# EAGLE design pcb_eagle (EAGLE 7.7.0)
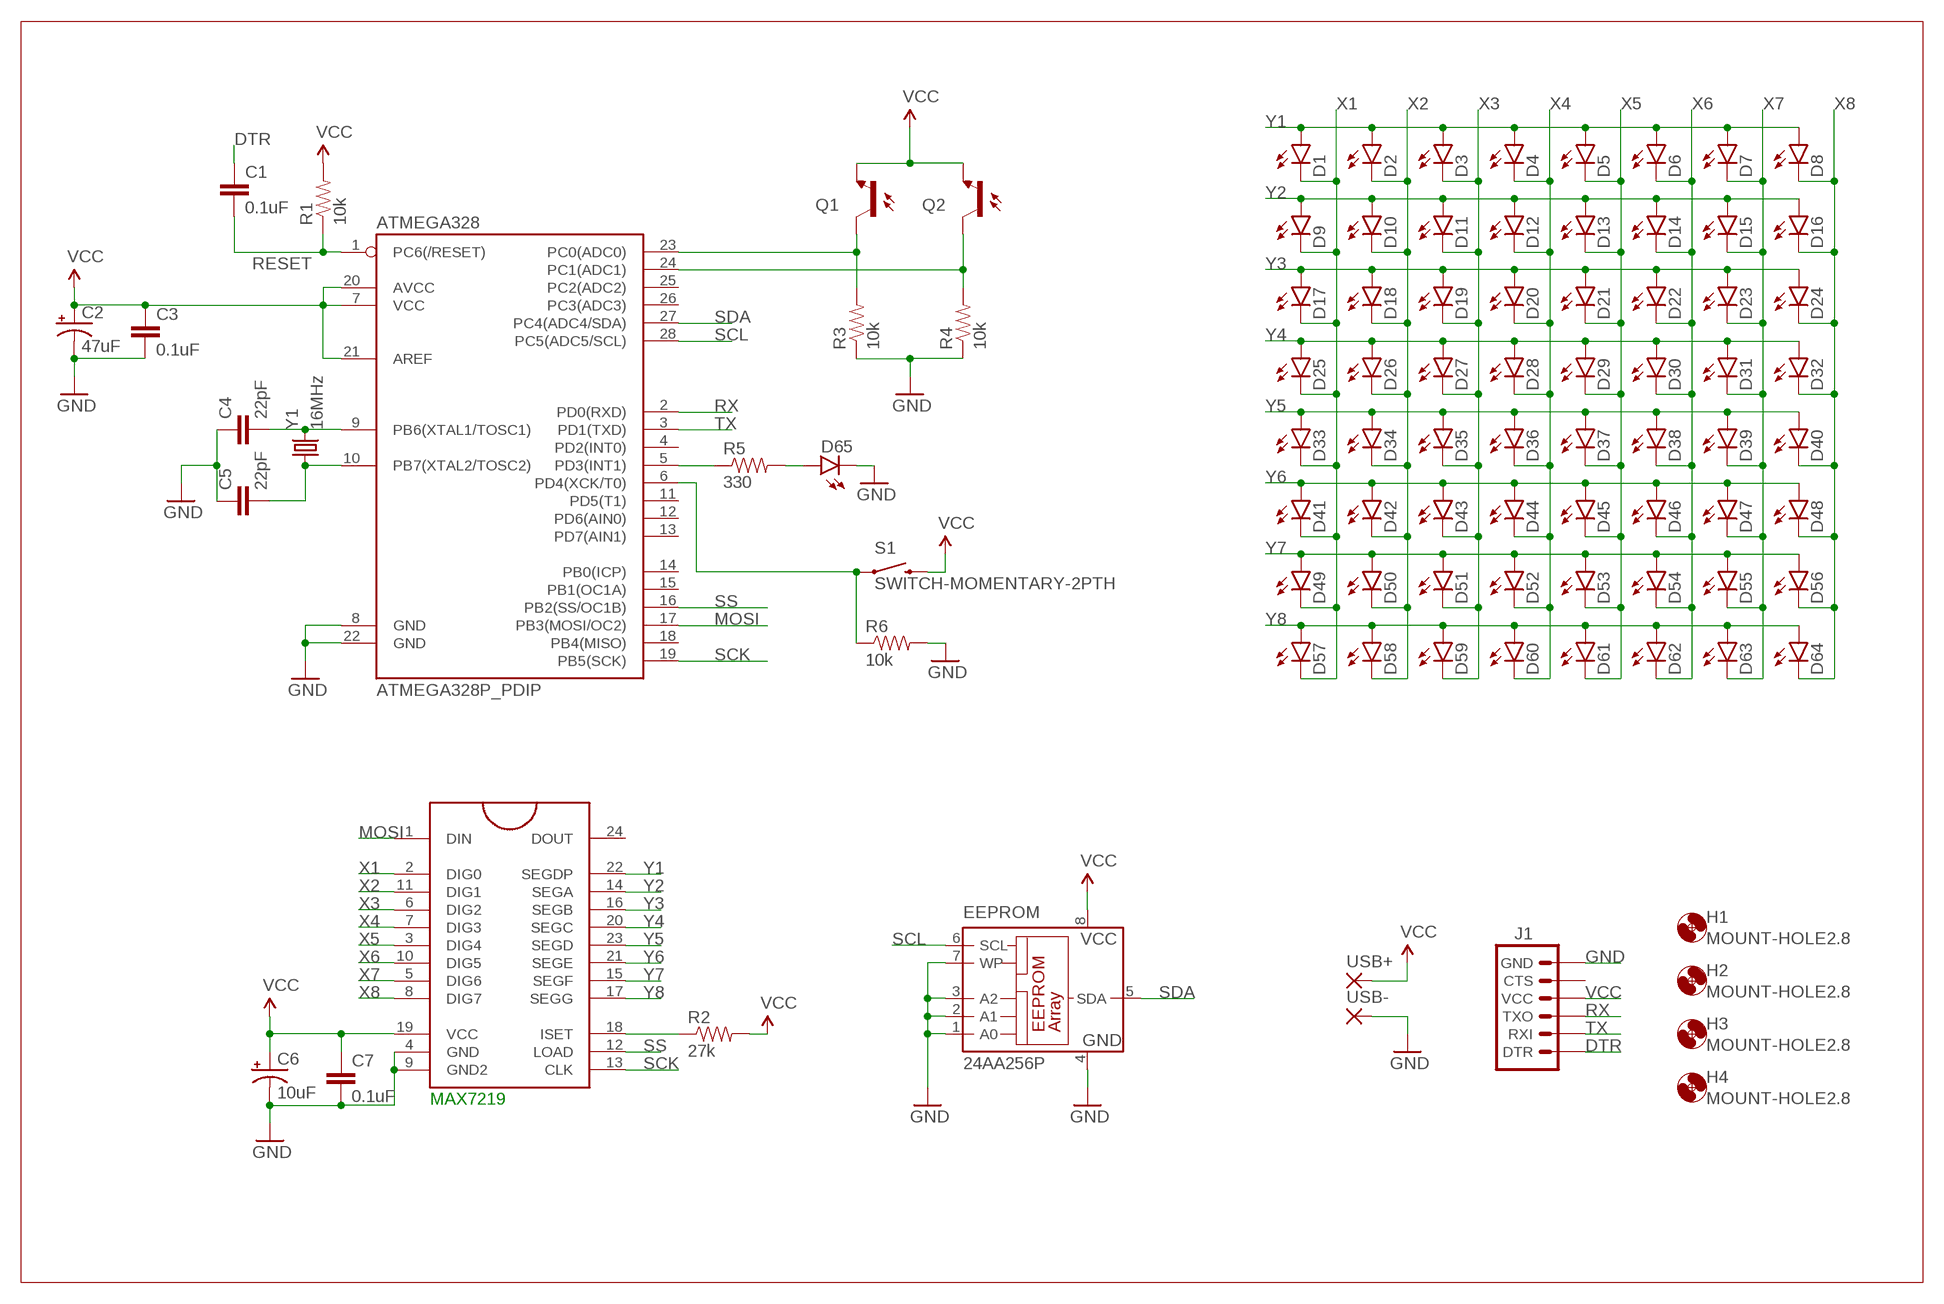
[diagram p0: schematic, sheet 1]

## Parts
ATMEGA328  ATMEGA328P_PDIP  [DIL28-3]
C1  0.1uF  CAPPTH  [CAP-PTH-SMALL]
C2  47uF  CAP_POLPTH2  [CPOL-RADIAL-10UF-25V]
C3  0.1uF  CAPPTH  [CAP-PTH-SMALL]
C4  22pF  CAPPTH  [CAP-PTH-SMALL]
C5  22pF  CAPPTH  [CAP-PTH-SMALL]
C6  10uF  CAP_POLPTH2  [CPOL-RADIAL-10UF-25V]
C7  0.1uF  CAPPTH  [CAP-PTH-SMALL]
D1  LED3MM  [LED3MM]
D2  LED3MM  [LED3MM]
D3  LED3MM  [LED3MM]
D4  LED3MM  [LED3MM]
D5  LED3MM  [LED3MM]
D6  LED3MM  [LED3MM]
D7  LED3MM  [LED3MM]
D8  LED3MM  [LED3MM]
D9  LED3MM  [LED3MM]
D10  LED3MM  [LED3MM]
D11  LED3MM  [LED3MM]
D12  LED3MM  [LED3MM]
D13  LED3MM  [LED3MM]
D14  LED3MM  [LED3MM]
D15  LED3MM  [LED3MM]
D16  LED3MM  [LED3MM]
D17  LED3MM  [LED3MM]
D18  LED3MM  [LED3MM]
D19  LED3MM  [LED3MM]
D20  LED3MM  [LED3MM]
D21  LED3MM  [LED3MM]
D22  LED3MM  [LED3MM]
D23  LED3MM  [LED3MM]
D24  LED3MM  [LED3MM]
D25  LED3MM  [LED3MM]
D26  LED3MM  [LED3MM]
D27  LED3MM  [LED3MM]
D28  LED3MM  [LED3MM]
D29  LED3MM  [LED3MM]
D30  LED3MM  [LED3MM]
D31  LED3MM  [LED3MM]
D32  LED3MM  [LED3MM]
D33  LED3MM  [LED3MM]
D34  LED3MM  [LED3MM]
D35  LED3MM  [LED3MM]
D36  LED3MM  [LED3MM]
D37  LED3MM  [LED3MM]
D38  LED3MM  [LED3MM]
D39  LED3MM  [LED3MM]
D40  LED3MM  [LED3MM]
D41  LED3MM  [LED3MM]
D42  LED3MM  [LED3MM]
D43  LED3MM  [LED3MM]
D44  LED3MM  [LED3MM]
D45  LED3MM  [LED3MM]
D46  LED3MM  [LED3MM]
D47  LED3MM  [LED3MM]
D48  LED3MM  [LED3MM]
D49  LED3MM  [LED3MM]
D50  LED3MM  [LED3MM]
D51  LED3MM  [LED3MM]
D52  LED3MM  [LED3MM]
D53  LED3MM  [LED3MM]
D54  LED3MM  [LED3MM]
D55  LED3MM  [LED3MM]
D56  LED3MM  [LED3MM]
D57  LED3MM  [LED3MM]
D58  LED3MM  [LED3MM]
D59  LED3MM  [LED3MM]
D60  LED3MM  [LED3MM]
D61  LED3MM  [LED3MM]
D62  LED3MM  [LED3MM]
D63  LED3MM  [LED3MM]
D64  LED3MM  [LED3MM]
D65  LED3MM  [LED3MM]
EEPROM  24AA256P  [DIL8]
H1  MOUNT-HOLE2.8  [2,8]
H2  MOUNT-HOLE2.8  [2,8]
H3  MOUNT-HOLE2.8  [2,8]
H4  MOUNT-HOLE2.8  [2,8]
J1  ARDUINO_SERIAL_PROGRAMPTH  [1X06]
MAX72191  MAX7219DIP  [DIL24]
Q1  PHOTOTRANSISTORT1  [LED3MM]
Q2  PHOTOTRANSISTORT1  [LED3MM]
R1  10k  RESISTORAXIAL-0.3  [AXIAL-0.3]
R2  27k  RESISTORAXIAL-0.3  [AXIAL-0.3]
R3  10k  RESISTORAXIAL-0.3  [AXIAL-0.3]
R4  10k  RESISTORAXIAL-0.3  [AXIAL-0.3]
R5  330  RESISTORAXIAL-0.3  [AXIAL-0.3]
R6  10k  RESISTORAXIAL-0.3  [AXIAL-0.3]
S1  SWITCH-MOMENTARY-2PTH  [TACTILE-PTH]
USB+  2,54/0,9  [2,54/0,9]
USB-  2,54/0,9  [2,54/0,9]
Y1  16MHz  CRYSTALHC49US  [HC49US]

## Nets
DTR: C1.1 J1.1(DTR)
GND: ATMEGA328.8(GND) ATMEGA328.22(GND) C2.2(-) C3.2 C4.1 C5.1 C6.2(-) C7.2 D65.K(C) EEPROM.1(A0) EEPROM.2(A1) EEPROM.3(A2) EEPROM.4(GND) EEPROM.7(WP) J1.6(GND) MAX72191.4(GND) MAX72191.9(GND2) R3.P$1 R4.P$1 R6.P$2 USB-.1(P)
MOSI: ATMEGA328.17(PB3(MOSI/OC2)) MAX72191.1(DIN)
N$1: ATMEGA328.9(PB6(XTAL1/TOSC1)) C4.2 Y1.2
N$2: ATMEGA328.10(PB7(XTAL2/TOSC2)) C5.2 Y1.1
N$3: MAX72191.18(ISET) R2.P$1
N$6: ATMEGA328.24(PC1(ADC1)) Q2.C R4.P$2
N$7: ATMEGA328.23(PC0(ADC0)) Q1.C R3.P$2
N$8: ATMEGA328.5(PD3(INT1)) R5.P$1
N$9: D65.A R5.P$2
N$12: ATMEGA328.6(PD4(XCK/T0)) R6.P$1 S1.1
RESET: ATMEGA328.1(PC6(/RESET)) C1.2 R1.P$1
RX: ATMEGA328.2(PD0(RXD)) J1.3(TXO)
SCK: ATMEGA328.19(PB5(SCK)) MAX72191.13(CLK)
SCL: ATMEGA328.28(PC5(ADC5/SCL)) EEPROM.6(SCL)
SDA: ATMEGA328.27(PC4(ADC4/SDA)) EEPROM.5(SDA)
SS: ATMEGA328.16(PB2(SS/OC1B)) MAX72191.12(LOAD)
TX: ATMEGA328.3(PD1(TXD)) J1.2(RXI)
VCC: ATMEGA328.7(VCC) ATMEGA328.20(AVCC) ATMEGA328.21(AREF) C2.1(+) C3.1 C6.1(+) C7.1 EEPROM.8(VCC) J1.4(VCC) MAX72191.19(VCC) Q1.E Q2.E R1.P$2 R2.P$2 S1.3 USB+.1(P)
X1: D1.K(C) D9.K(C) D17.K(C) D25.K(C) D33.K(C) D41.K(C) D49.K(C) D57.K(C) MAX72191.2(DIG0)
X2: D2.K(C) D10.K(C) D18.K(C) D26.K(C) D34.K(C) D42.K(C) D50.K(C) D58.K(C) MAX72191.11(DIG1)
X3: D3.K(C) D11.K(C) D19.K(C) D27.K(C) D35.K(C) D43.K(C) D51.K(C) D59.K(C) MAX72191.6(DIG2)
X4: D4.K(C) D12.K(C) D20.K(C) D28.K(C) D36.K(C) D44.K(C) D52.K(C) D60.K(C) MAX72191.7(DIG3)
X5: D5.K(C) D13.K(C) D21.K(C) D29.K(C) D37.K(C) D45.K(C) D53.K(C) D61.K(C) MAX72191.3(DIG4)
X6: D6.K(C) D14.K(C) D22.K(C) D30.K(C) D38.K(C) D46.K(C) D54.K(C) D62.K(C) MAX72191.10(DIG5)
X7: D7.K(C) D15.K(C) D23.K(C) D31.K(C) D39.K(C) D47.K(C) D55.K(C) D63.K(C) MAX72191.5(DIG6)
X8: D8.K(C) D16.K(C) D24.K(C) D32.K(C) D40.K(C) D48.K(C) D56.K(C) D64.K(C) MAX72191.8(DIG7)
Y1: D1.A D2.A D3.A D4.A D5.A D6.A D7.A D8.A MAX72191.22(SEGDP)
Y2: D9.A D10.A D11.A D12.A D13.A D14.A D15.A D16.A MAX72191.14(SEGA)
Y3: D17.A D18.A D19.A D20.A D21.A D22.A D23.A D24.A MAX72191.16(SEGB)
Y4: D25.A D26.A D27.A D28.A D29.A D30.A D31.A D32.A MAX72191.20(SEGC)
Y5: D33.A D34.A D35.A D36.A D37.A D38.A D39.A D40.A MAX72191.23(SEGD)
Y6: D41.A D42.A D43.A D44.A D45.A D46.A D47.A D48.A MAX72191.21(SEGE)
Y7: D49.A D50.A D51.A D52.A D53.A D54.A D55.A D56.A MAX72191.15(SEGF)
Y8: D57.A D58.A D59.A D60.A D61.A D62.A D63.A D64.A MAX72191.17(SEGG)
Unconnected: ATMEGA328.4(PD2(INT0)) ATMEGA328.11(PD5(T1)) ATMEGA328.12(PD6(AIN0)) ATMEGA328.13(PD7(AIN1)) ATMEGA328.14(PB0(ICP)) ATMEGA328.15(PB1(OC1A)) ATMEGA328.18(PB4(MISO)) ATMEGA328.25(PC2(ADC2)) ATMEGA328.26(PC3(ADC3)) J1.5(CTS) MAX72191.24(DOUT)

## Notes on the sheet
- MAX7219

## Library data of the parts
ATMEGA328 = SparkFun-DigitalIC:ATMEGA328P_PDIP: uC used in the Arduino 32kb flash, 1k EEPROM, 2k SRAM This is the through-hole version of this chip.
C1 C3-C5 C7 = SparkFun-Capacitors:CAP: Capacitor Standard 0603 ceramic capacitor, and 0.1" leaded capacitor.
C2 C6 = SparkFun-Capacitors:CAP_POL: Capacitor Polarized These are standard SMD and PTH capacitors. Normally 10uF, 47uF, and 100uF in electrolytic and tantalum varieties. Always verify the external diameter of the through hole cap, it varies with capacity, voltage, and manufacturer. The EIA devices should be standard.
D1-D65 = SparkFun-LED:LED: LEDs Standard schematic elements and footprints for 5mm, 3mm, 1206, and 0603 sized LEDs. 5mm - Spark Fun Electronics SKU : COM-00529 (and others); PROD_ID: DIO-08794
EEPROM = microchip:24*: Serial EEPROM I2C; MF: MICROCHIP; MPN: 24AA256-I/P; OC_FARNELL: 1331294; OC_NEWARK: 92C6872
H1-H4 = holes:MOUNT-HOLE: MOUNTING HOLE with drill center marker
J1 = SparkFun-Connectors:ARDUINO_SERIAL_PROGRAM: FTDI connector footprints
MAX72191 = SparkFun-DigitalIC:MAX7219: 8-digit, 8-segment LED display driver, serial input
Q1 Q2 = BobVanHove:PHOTOTRANSISTOR
R1 R3-R6 = SparkFun-Passives:RESISTOR: Resistor Basic schematic elements and footprints for 0603, 1206, and PTH resistors.
R2 = SparkFun-Resistors:RESISTOR: Resistor Basic schematic elements and footprints for 0603, 1206, and PTH resistors.
S1 = SparkFun-Electromechanical:SWITCH-MOMENTARY-2: Various NO switches- pushbuttons, reed, etc; PROD_ID: SWCH-08441
USB+ USB- = wirepad:2,54/0,9: THROUGH-HOLE PAD
Y1 = SparkFun-FreqCtrl:CRYSTAL: Various standard crystals. Proven footprints.

## Board
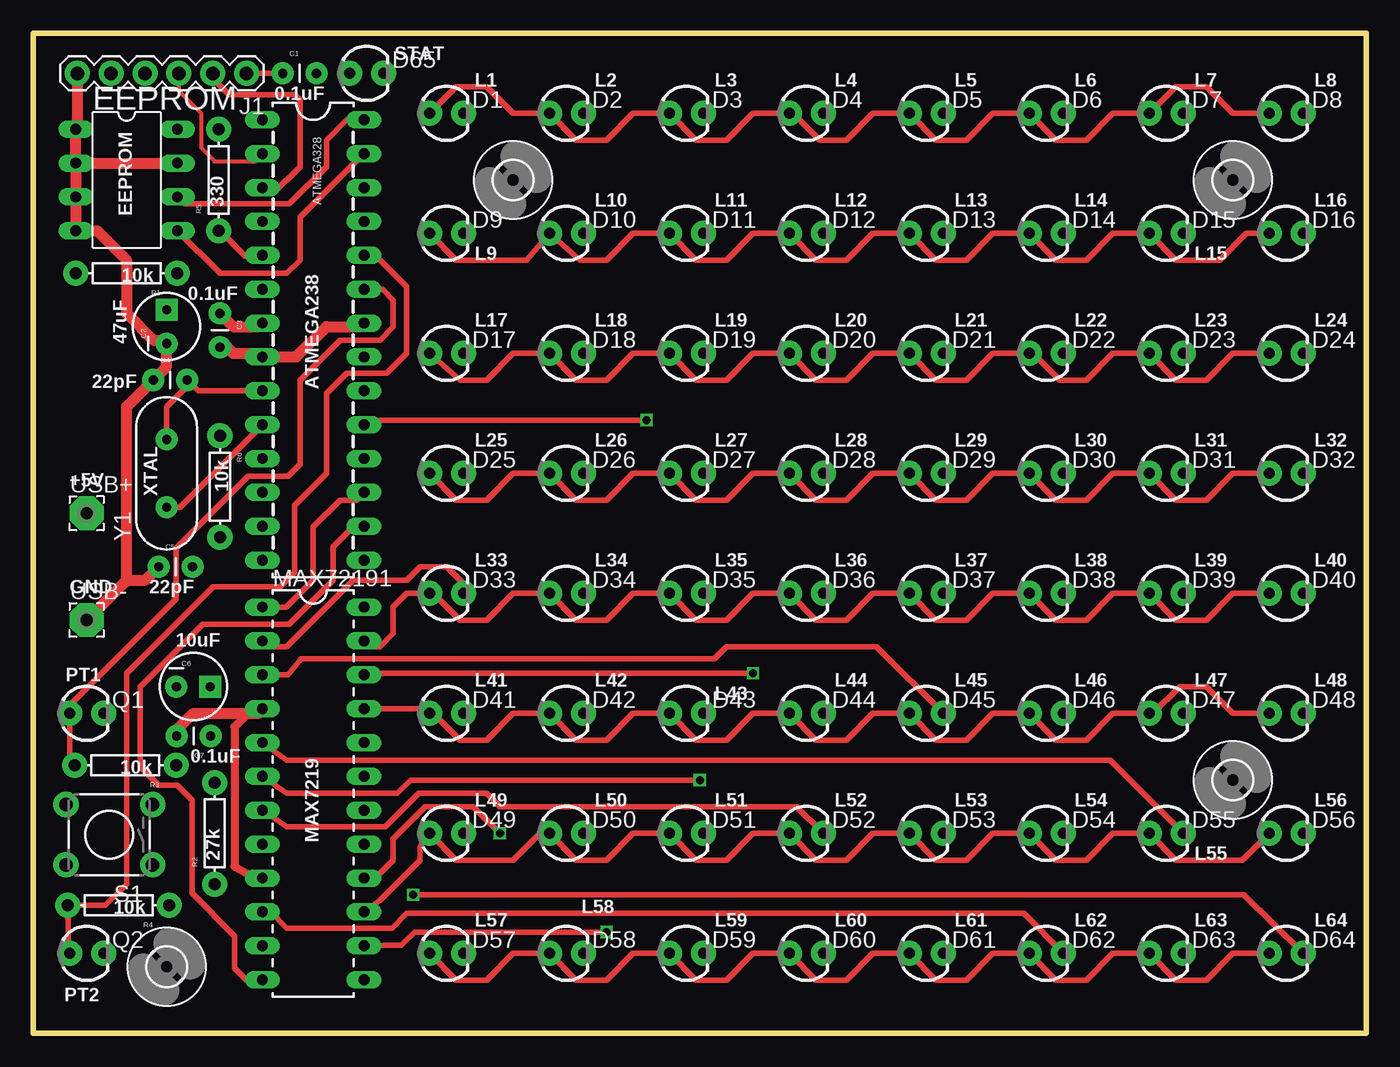
[diagram p1: board, top side]
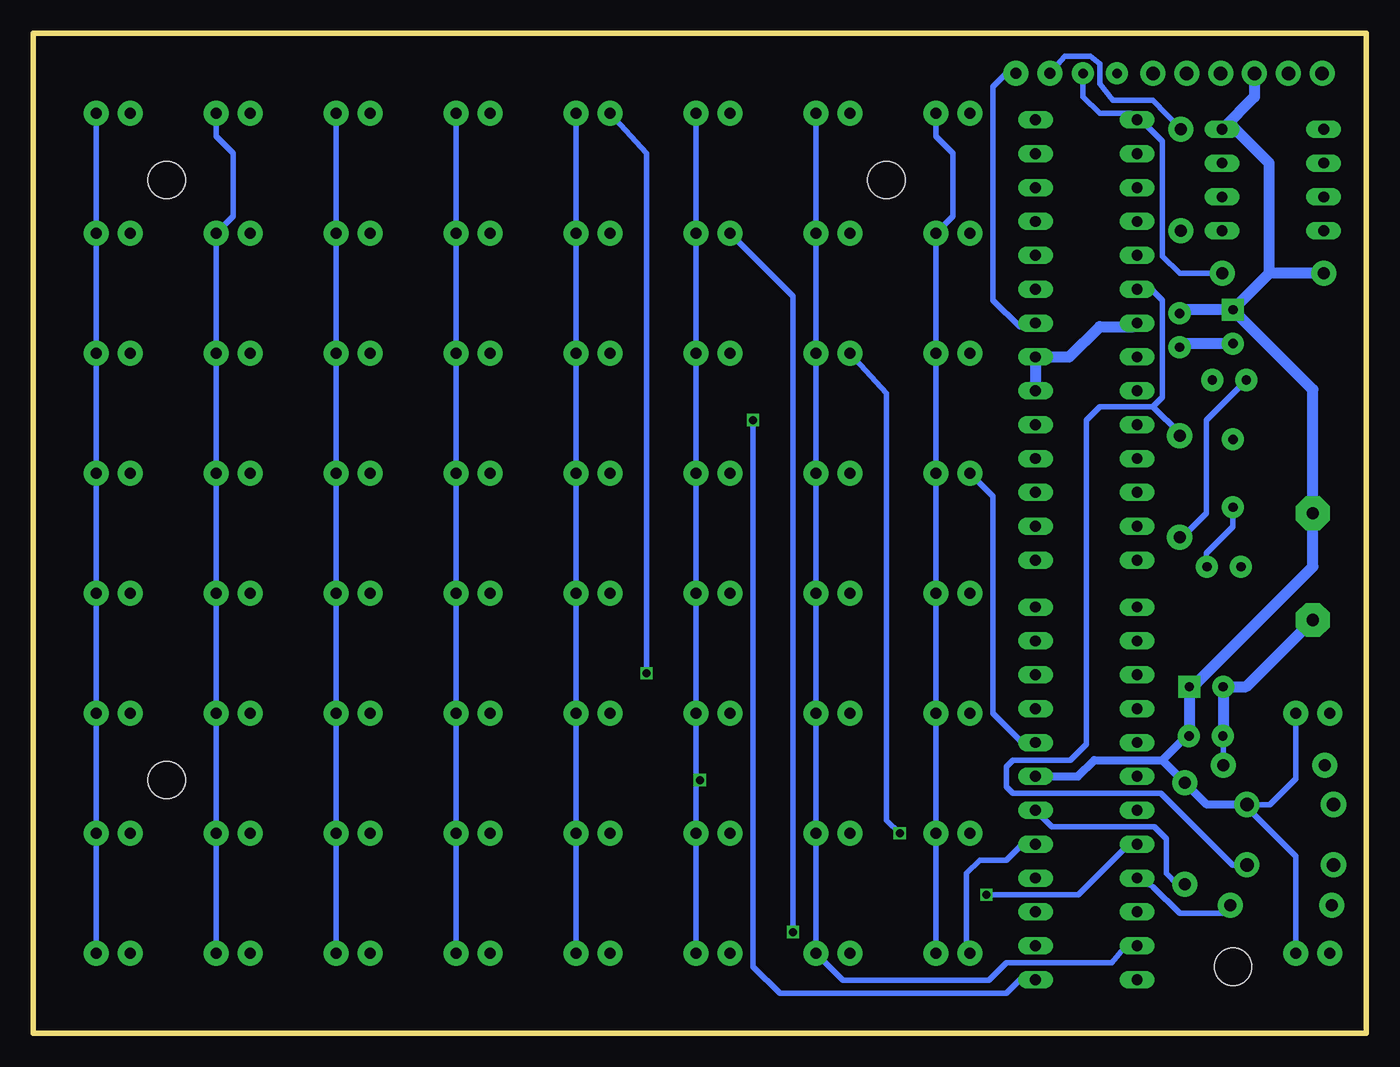
[diagram p2: board, bottom side, seen from below]

Size 100 x 75 mm. Coordinates in mm from the lower left corner, seen from the top.
Outline: 0,0 100,0 100,75 0,75 0,0
Copper layers (1*16): Top 0.035mm / dielectric 1.5mm / Bottom 0.035mm
Design rules "SeeedStudio_2layer_DRU_no_angle_20140221": minimum track width 6mil, minimum drill 12mil, track to track 6mil, track to pad 6mil, pad to pad 6mil, via to via 6mil, smd to smd 0mil, copper to edge 10mil, drill to drill 10mil, minimum pad ring 10mil, minimum via ring 6mil, stop-mask expansion 2mil, vias tented up to drill 100mil, thermal gap 10mil

### Footprints (pad centres in the part's own frame; a part is rotated, then mirrored left to right if it is on the bottom)
DIL28-3 = drill 0.813 long: 1 -16.51,-3.81; 2 -13.97,-3.81; 3 -11.43,-3.81; 4 -8.89,-3.81; 5 -6.35,-3.81; 6 -3.81,-3.81; 7 -1.27,-3.81; 8 1.27,-3.81; 9 3.81,-3.81; 10 6.35,-3.81; 11 8.89,-3.81; 12 11.43,-3.81; 13 13.97,-3.81; 14 16.51,-3.81; 15 16.51,3.81; 16 13.97,3.81; 17 11.43,3.81; 18 8.89,3.81; 19 6.35,3.81; 20 3.81,3.81; 21 1.27,3.81; 22 -1.27,3.81; 23 -3.81,3.81; 24 -6.35,3.81; 25 -8.89,3.81; 26 -11.43,3.81; 27 -13.97,3.81; 28 -16.51,3.81
CAP-PTH-SMALL = drill 0.7 pad 1.651: 1 0,0; 2 2.54,0
CPOL-RADIAL-10UF-25V = drill 0.7 pad 1.651 square: 1 1.27,0 | drill 0.7 pad 1.651: 2 -1.27,0
LED3MM = drill 0.813 pad 1.88: A -1.27,0; K 1.27,0
DIL8 = drill 0.813 long: 1 -3.81,-3.81; 2 -1.27,-3.81; 3 1.27,-3.81; 4 3.81,-3.81; 5 3.81,3.81; 6 1.27,3.81; 7 -1.27,3.81; 8 -3.81,3.81
2,8 = hole 2.8: 0,0
1X06 = drill 1.016 pad 1.88: 1 0,0; 2 2.54,0; 3 5.08,0; 4 7.62,0; 5 10.16,0; 6 12.7,0
DIL24 = drill 0.813 long: 1 -13.97,-3.81; 2 -11.43,-3.81; 3 -8.89,-3.81; 4 -6.35,-3.81; 5 -3.81,-3.81; 6 -1.27,-3.81; 7 1.27,-3.81; 8 3.81,-3.81; 9 6.35,-3.81; 10 8.89,-3.81; 11 11.43,-3.81; 12 13.97,-3.81; 13 13.97,3.81; 14 11.43,3.81; 15 8.89,3.81; 16 6.35,3.81; 17 3.81,3.81; 18 1.27,3.81; 19 -1.27,3.81; 20 -3.81,3.81; 21 -6.35,3.81; 22 -8.89,3.81; 23 -11.43,3.81; 24 -13.97,3.81
LED3MM' = drill 0.813 pad 1.88: C -1.27,0; E 1.27,0
AXIAL-0.3 = drill 0.9 pad 1.88: P$1 -3.81,0; P$2 3.81,0
TACTILE-PTH = drill 1.016 pad 1.88: 1 -3.251,2.261; 2 3.251,2.261; 3 -3.251,-2.261; 4 3.251,-2.261
2,54/0,9 = drill 0.914 pad 2.54 octagon: 1 0,0
HC49US = drill 0.7 pad 1.651: 1 -2.54,0; 2 2.54,0

### Placement (x,y rotation side)
ATMEGA328  21,52 270 top
C1  18.7,72 0 top
C2  10,53 90 top
C3  14,54 270 top
C4  9,49 0 top
C5  9.4,35 0 top
C6  12,26 0 top
C7  13.3,22.3 180 top
D1  31,69 0 top
D2  40,69 0 top
D3  49,69 0 top
D4  58,69 0 top
D5  67,69 0 top
D6  76,69 0 top
D7  85,69 0 top
D8  94,69 0 top
D9  31,60 0 top
D10  40,60 0 top
D11  49,60 0 top
D12  58,60 0 top
D13  67,60 0 top
D14  76,60 0 top
D15  85,60 0 top
D16  94,60 0 top
D17  31,51 0 top
D18  40,51 0 top
D19  49,51 0 top
D20  58,51 0 top
D21  67,51 0 top
D22  76,51 0 top
D23  85,51 0 top
D24  94,51 0 top
D25  31,42 0 top
D26  40,42 0 top
D27  49,42 0 top
D28  58,42 0 top
D29  67,42 0 top
D30  76,42 0 top
D31  85,42 0 top
D32  94,42 0 top
D33  31,33 0 top
D34  40,33 0 top
D35  49,33 0 top
D36  58,33 0 top
D37  67,33 0 top
D38  76,33 0 top
D39  85,33 0 top
D40  94,33 0 top
D41  31,24 0 top
D42  40,24 0 top
D43  49,24 0 top
D44  58,24 0 top
D45  67,24 0 top
D46  76,24 0 top
D47  85,24 0 top
D48  94,24 0 top
D49  31,15 0 top
D50  40,15 0 top
D51  49,15 0 top
D52  58,15 0 top
D53  67,15 0 top
D54  76,15 0 top
D55  85,15 0 top
D56  94,15 0 top
D57  31,6 0 top
D58  40,6 0 top
D59  49,6 0 top
D60  58,6 0 top
D61  67,6 0 top
D62  76,6 0 top
D63  85,6 0 top
D64  94,6 0 top
D65  25,72 0 top
EEPROM  7,64 270 top
H1  10,5 0 top
H2  90,64 0 top
H3  36,64 0 top
H4  90,19 0 top
J1  16,72 180 top
MAX72191  21,18 270 top
Q1  [LED3MM']  4,24 0 top
Q2  [LED3MM']  4,6 0 top
R1  7,57 180 top
R2  13.6,15 90 top
R3  6.9,20.1 180 top
R4  6.4,9.6 180 top
R5  13.9,64 90 top
R6  14,41 270 top
S1  5.7,14.9 180 top
USB+  4,39 0 top
USB-  4,31 0 top
Y1  10,42 90 top

### Tracks (layer width: path | path; a pad name or v marks a point on that pad's centre or on a via)
DTR
  Top 0.406: C1.1 J1.1
GND
  Top 0.406: 3.3,67.92 EEPROM.1 | 24.54,53 ATMEGA328.22 | 16.92,51 ATMEGA328.8
  Top 0.61: MAX72191.9 16,12 15.1,12.5 15.1,23 16.45,24.35 MAX72191.4
  Top 0.813: J1.6 3.3,67.92 | EEPROM.2 EEPROM.1 | EEPROM.2 EEPROM.3 EEPROM.4 4.81,60.19 7,58 7,54 9,52 9.73,52 C2.2 10,50 C4.1 7,47 7,34 | EEPROM.2 EEPROM.7 | ATMEGA328.8 19.73,50.73 22,53 24.54,53 | C3.2 14.54,51.46 15,51 16.92,51 | USB-.1 7,34 | 7,34 8.4,34 C5.1 | C7.2 10.76,22.76 12,24 16.84,24 MAX72191.4
  Bottom 0.406: D65.K 27,72 28,71 28,55 26,53 25.08,53 ATMEGA328.22 | 13.73,51.73 C3.2 | C2.2 9.73,51.73 | C4.1 12,46 12,39 13.81,37.19 R6.P$2 | MAX72191.9 16,11 14,9 10.81,9 R4.P$1 | R3.P$1 10.71,22.25 C7.2
  Bottom 0.813: C2.2 13.73,51.73 | USB-.1 9,26 C6.2 10.73,22.73 C7.2
MOSI
  Top 0.406: MAX72191.1 18.97,31.97 21,34 21,38 23,40 24.24,40 ATMEGA328.17
N$1
  Top 0.406: ATMEGA328.9 12.35,48.19 C4.2 11.54,48.54 10,47 Y1.2
N$2
  Top 0.406: Y1.1 11,39.46 ATMEGA328.10
  Bottom 0.406: Y1.1 10,38 12,36 12,35.06 C5.2
N$3
  Bottom 0.406: R2.P$1 14.19,11.19 15,12 15,14.6 15.9,15.5 23.58,15.5 MAX72191.18
N$6
  Top 0.406: ATMEGA328.24 25.65,58.35 28,56 28,51 26.5,49.5 23.5,49.5 22,48 22,42 19.6,39.6 19.6,34.6 18.5,33.5 13.5,33.5 7,27 7,11.2 5.4,9.6 R4.P$2 2.59,8.68 2.6,8.67 2.6,6 Q2.C
N$7
  Top 0.406: ATMEGA328.23 26.19,55.81 27,55 27,53 26,52 23,52 20,49 20,42.7 19.1,41.8 16.1,41.8 10.7,36.4 10.7,32.6 2.8,24.7 2.8,24.07 Q1.C 2.73,20.46 R3.P$2
N$8
  Top 0.406: R5.P$1 14.01,60.19 15.9,58.3 17.14,58.3 ATMEGA328.5
N$9
  Bottom 0.406: D65.A 22.6,73.3 20.7,73.3 20,72.7 20,71.2 19,70 16,70 R5.P$2
N$12
  Bottom 0.406: ATMEGA328.6 16.11,55.81 15.3,55 15.3,47.7 16,47 | R6.P$1 14,45 16,47 | 16,47 20,47 21,46 21,21.7 22.2,20.5 26.5,20.5 27,20 27,18.5 26.5,18 15.4,18 10,12.6 8.99,12.6 S1.1
RESET
  Bottom 0.406: C1.2 21.24,70.24 20,69 17.68,69 ATMEGA328.1 16.91,68.51 15.3,66.9 15.3,58.3 14,57 R1.P$1
RX
  Top 0.305: J1.3 10.92,70.68 12.6,69 12.6,66.4 13.6,65.4 16.62,65.4 ATMEGA328.2
SCK  (via drill 0.6)
  Top 0.406: v46,46 26,46 ATMEGA328.19
  Bottom 0.406: MAX72191.13 25.97,4.03 27,3 44,3 46,5 v46,46
SCL
  Top 0.406: ATMEGA328.28 23.51,68.51 22,67 22,65 19.2,62.2 11.34,62.2 EEPROM.6
SDA
  Top 0.406: ATMEGA328.27 24.47,65.67 20,61.2 20,58 19,57 14,57 EEPROM.5
SS
  Top 0.406: ATMEGA328.16 24.03,38.03 22.5,36.5 22.5,34 19.2,30.7 12.7,30.7 8,26 8,20 9.4,18.6 10.8,18.6 11.9,17.5 11.9,10.5 15.1,7.3 15.1,4.9 16,4 17.16,4 MAX72191.12
TX
  Top 0.406: J1.2 13.46,71.64 14.7,70.4 19.6,70.4 20,70 20,65 18,63 17.62,63 ATMEGA328.3
VCC
  Top 0.813: C3.1 15,53 16.92,53 ATMEGA328.7
  Bottom 0.406: 13.73,54.27 C3.1 | 17.46,53 ATMEGA328.7 | Q2.E 5.3,6.57 5.3,13.3 8.95,16.95 S1.3 7.24,17.16 5.3,19.1 5.3,23.97 Q1.E
  Bottom 0.61: MAX72191.19 21.63,19.27 20.4,20.5 15.29,20.5 | 13.41,19 R2.P$2 | 15.29,20.5 R2.P$2 | C7.1 13.49,22.3 15.29,20.5 | S1.3 11.95,17.16 R2.P$2
  Bottom 0.813: J1.4 8.38,70.24 EEPROM.8 10.62,68 10,68 7.27,65.27 7.27,57 | 7.27,57 C2.1 | C2.1 13.73,54.27 | 17.46,53 20,53 22.27,50.73 ATMEGA328.21 ATMEGA328.20 | R1.P$2 7.27,57 | C2.1 4,48.27 USB+.1 4,35 13,26 C6.1 13.27,22.33 C7.1
X1
  Top 0.406: D33.K 32.27,33.73 31,35 29,35 28,34 24,34 19,29 17.62,29 MAX72191.2
  Bottom 0.406: D57.K D49.K D41.K D33.K D25.K D17.K D9.K 31,61.27 31,66 32.27,67.27 D1.K
X2
  Bottom 0.406: D2.K D10.K D18.K D26.K D34.K D42.K D50.K D58.K 39.27,4 28.3,4 27,5.3 19.1,5.3 18.03,6.57 MAX72191.11
X3  (via drill 0.6)
  Top 0.406: MAX72191.6 19,18 27.3,18 28.3,19 v50,19
  Bottom 0.406: D3.K D11.K D19.K D27.K D35.K D43.K 50.27,19.27 v50,19 50.27,18.73 D51.K D59.K
X4
  Top 0.406: D52.K 57.27,17 35,17 34,18 28.9,18 26.4,15.5 19,15.5 MAX72191.7
  Bottom 0.406: D4.K D12.K D20.K D28.K D36.K D44.K D52.K D60.K
X5
  Top 0.406: MAX72191.3 19.11,26.89 20.1,28.1 51.1,28.1 52,29 63.27,29 D45.K
  Bottom 0.406: D5.K D13.K D21.K D29.K D37.K D45.K D53.K D61.K
X6
  Top 0.406: MAX72191.10 17.79,9.11 19,7.9 26.9,7.9 28,9 74.3,9 D62.K
  Bottom 0.406: D6.K D14.K D22.K D30.K D38.K D46.K D54.K D62.K
X7
  Top 0.406: MAX72191.5 19,20.5 80.8,20.5 D55.K
  Bottom 0.406: D63.K D55.K D47.K D39.K D31.K D23.K D15.K 85,61.27 85,66 86.27,67.27 D7.K
X8  (via drill 0.6)
  Top 0.406: v28.5,10.4 90.8,10.4 D64.K
  Bottom 0.406: D8.K D16.K D24.K D32.K D40.K D48.K D56.K D64.K | MAX72191.8 18,14 21.6,10.4 v28.5,10.4
Y1  (via drill 0.6)
  Top 0.406: 24.89,26.99 25,26.99 | 25,26.99 v54,27 | D1.A 31.73,71 34,71 36,69 D2.A 40.73,67 43,67 45,69 D3.A 49.73,67 52,67 54,69 D4.A 57,69 59,67 61,67 63,69 D5.A 67.73,67 70,67 72,69 D6.A 76.73,67 79,67 81,69 D7.A 85.73,71 88,71 90,69 D8.A | MAX72191.22 24.9,26.89 25,26.99
  Bottom 0.406: v54,27 54,66 D4.A
Y2  (via drill 0.6)
  Top 0.406: D16.A 91,60 89,58 85.73,58 D15.A 81,60 79,58 76.73,58 D14.A 72,60 70,58 67.73,58 D13.A 63,60 61,58 58.73,58 D12.A 54,60 52,58 49.73,58 D11.A 45,60 43,58 41,58 D10.A 37,58 31.73,58 D9.A | MAX72191.14 26.3,6.6 27.6,6.6 28.6,7.6 v43,7.6
  Bottom 0.406: v43,7.6 43,55.3 D11.A
Y3  (via drill 0.6)
  Top 0.406: D24.A 90,51 88,49 85.73,49 D23.A 81,51 79,49 77,49 75,51 D22.A 72,51 70,49 67.73,49 D21.A 63,51 61,49 58.73,49 D20.A 54,51 52,49 49.73,49 D19.A 45,51 43,49 40.73,49 D18.A 36,51 34,49 32,49 D17.A | v35,15 33,17 29.4,17 27,14.6 27,13 26,12 MAX72191.16
  Bottom 0.406: v35,15 36,16 36,48 D18.A
Y4
  Top 0.406: D32.A 90,42 88,40 85.73,40 D31.A 81,42 79,40 76.73,40 D30.A 72,42 70,40 67.73,40 D29.A 63,42 61,40 58.73,40 D28.A 54,42 52,40 49.73,40 D27.A 45,42 43,40 40.73,40 D26.A 36,42 34,40 31.73,40 D25.A
  Bottom 0.406: MAX72191.20 25.81,21.81 28,24 28,40.27 D25.A
Y5
  Top 0.406: D40.A 90,33 88,31 85.73,31 D39.A 81,33 79,31 76.73,31 D38.A 72,33 70,31 67.73,31 D37.A 63,33 61,31 58.73,31 D36.A 54,33 52,31 49.73,31 D35.A 45,33 43,31 40.73,31 D34.A 36,33 34,31 32,31 30,33 D33.A 28,33 27,32 27,30 26,29 25.24,29 MAX72191.23
Y6
  Top 0.406: D48.A 90,24 88,26 86,26 84,24 D47.A 81,24 79,22 76.73,22 D46.A 72,24 70,22 67.73,22 D45.A 63,24 61,22 58.73,22 D44.A 54,24 52,22 49.73,22 D43.A 45,24 43,22 40.73,22 D42.A 36,24 34,22 32,22 30,24 D41.A 29.38,24.35 MAX72191.21
Y7
  Top 0.406: D56.A 90.7,13 85.73,13 D55.A 81,15 79,13 76.73,13 D54.A 72,15 70,13 67.73,13 D53.A 63,15 61,13 58.73,13 D52.A 54,15 52,13 49.73,13 D51.A 45,15 43,13 40.73,13 D50.A 38,15 36,13 31.73,13 D49.A 29,14 29,13 26,10 MAX72191.15
Y8
  Top 0.406: D64.A 90,6 88,4 85.73,4 D63.A 81,6 79,4 76.73,4 D62.A 72,6 70,4 67.73,4 D61.A 63,6 61,4 58.73,4 D60.A 54,6 52,4 49.73,4 D59.A 45,6 43,4 40.73,4 D58.A 36,6 34,4 31.73,4 D57.A
  Bottom 0.406: D57.A 30,6.27 30,12 29,13 27,13 26,14 MAX72191.17

### Text on the board
tPlace: STAT | L1 | L2 | L3 | L4 | L5 | L6 | L7 | L8 | 0.1uF | L10 | L11 | L12 | L13 | L14 | L16 | EEPROM | L9 | L15 | 0.1uF | L17 | L18 | L19 | L20 | L21 | L22 | L23 | L24 | 47uF | 22pF | ATMEGA238 | L25 | L26 | L27 | L28 | L29 | L30 | L31 | L32 | +5V | XTAL | L33 | L34 | L35 | L36 | L37 | L38 | L39 | L40 | GND | 22pF | 10uF | PT1 | L41 | L42 | L44 | L45 | L46 | L47 | L48 | L43 | 0.1uF | L49 | L50 | L51 | L52 | L53 | L54 | L56 | MAX7219 | L55 | L58 | L57 | L59 | L60 | L61 | L62 | L63 | L64 | PT2